# Altium schematic sheet SPDIF.SchDoc: Apalis Evaluation Board 1.1
size A3; Organization: Toradex AG; Address1: Altsagenstrasse 5; Address2: Horw; Address3: 6048; Address4: Switzerland; DocumentNumber: 13; Revision: V1.1; SheetNumber: 13; SheetTotal: 32; PageSetup: Record=PageOptions|CenterHorizontal=True|CenterVertical=True|PrintScale=0.73|XCorrection=1.00|YCorrection=1.00|PrintKind=0|BorderSize=5000000|LeftOffset=0|BottomOffset=0|Orientation=2|PaperLength=1000|PaperWidth=1000|Scale=100|PaperSource=7|PrintQuality=-4|MediaType=1|DitherType=10|PaperKind=A4|PrintScaleMode=1
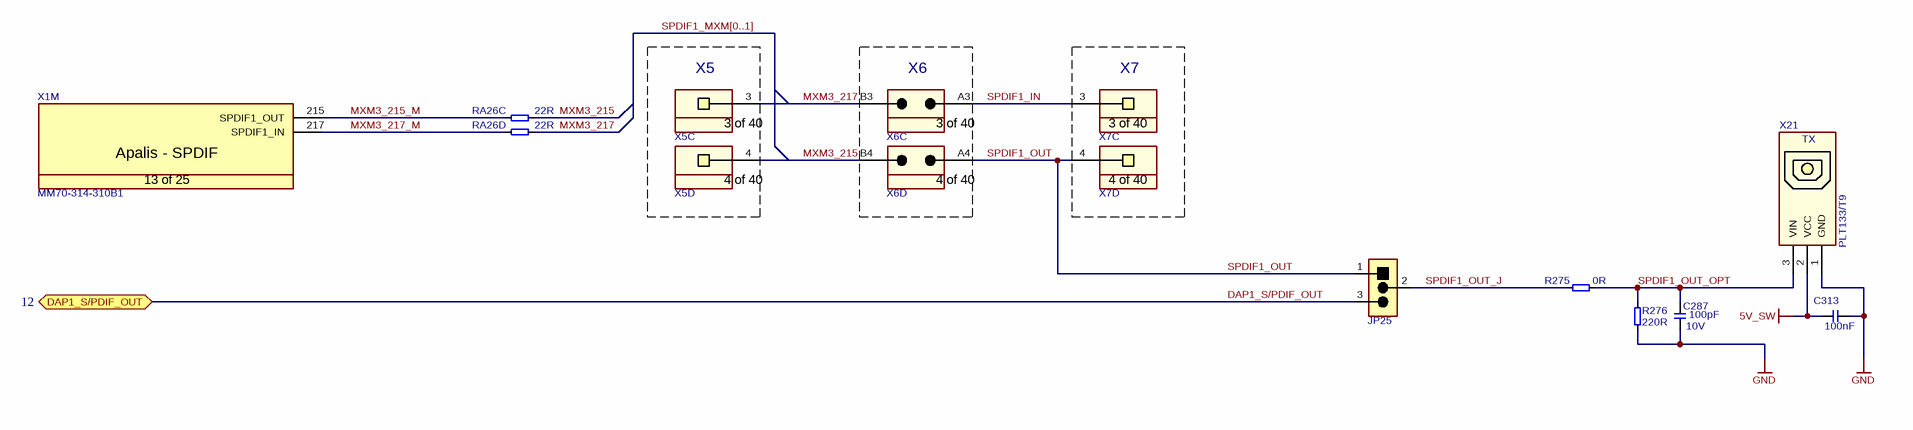
[diagram p0: SPDIF.SchDoc]

## Parts
C287  Rating: 10V  [T_CAPC0603X33N]  (hidden comment: 100pF)
C313  100nF  [T_CAPC0603X33N]
JP25  826936-3  [T_TYCO_826936-3]  (value not drawn)
R275  0R  [T_RESC0603X30N]
R276  220R  [T_RESC0603X30N]
RA26  22R  [T_Resistor_Array_X4]  (parts C,D of 4)
X1  Manufacturer Part No.: MM70-314-310B1  [T_JAE_MM70-314-310B1]  (hidden comment: CON-JAE-MM70-314-310B1-314-0.5mm)  (part M of 25)
X5  SSW-110-01-G-S  [T_Samtec_SSW-110-01-G-S]  (value not drawn)  (parts C,D of 40)
X6  TSW-110-07-G-D  [T_Samtec_TSW-110-07-G-D]  (value not drawn)  (parts C,D of 40)
X7  SSW-110-01-G-S  [T_Samtec_SSW-110-01-G-S]  (value not drawn)  (parts C,D of 40)
X21  PLT133/T9  [T_EVERLIGHT_PLT133/T9]

## Blocks framed on the sheet
X5: X5
X6: X6
X7: X7

## Ports
DAP1_S/PDIF_OUT (bidir, see 12)

## Nets
5V_SW: C313.1 X21.2(VCC)
GND: C287.1 C313.2 R276.1 X21.1(GND)
DAP1_S/PDIF_OUT: JP25.3 ; port DAP1_S/PDIF_OUT
MXM3_215: RA26.7 X5.4 X6.B4
MXM3_215_M: RA26.3 X1.215(SPDIF1_OUT)
MXM3_217: RA26.8 X5.3 X6.B3
MXM3_217_M: RA26.4 X1.217(SPDIF1_IN)
SPDIF1_IN: X6.A3 X7.3
SPDIF1_OUT: JP25.1 X6.A4 X7.4
SPDIF1_OUT_J: JP25.2 R275.1
SPDIF1_OUT_OPT: C287.2 R275.2 R276.2 X21.3(VIN)

## Buses and harness runs
bus SPDIF1_MXM[0..1]

## Notes on the sheet
- Title
- Size:
- Date:
- A3
- Number:
- Time:
- Revision:
- Sheet
- of
- File:
- (in symbol CON-JAE-MM70-314-310B1-314-0.5mm, part M) Apalis - SPDIF; 13 of 25
- (in symbol CON-Samtec-SSW-110-01-G-S, part C) 3 of 40
- (in symbol CON-Samtec-SSW-110-01-G-S, part D) 4 of 40
- (in symbol CON-Samtec-TSW-110-07-G-D, part C) 3 of 40
- (in symbol CON-Samtec-TSW-110-07-G-D, part D) 4 of 40
- (in symbol IF-Everlight-PLT133/T9) TX

## Library data of the parts
C287 = C-X7R-100pF-10V-20%-0603: Capacitor Ceramic X7R 100pF 10V 20% 0603; Tolerance: 20%; Type: X7R; Value: 100pF
C313 = C-X7R-100nF-16V-10%-0603: Capacitor Ceramic X7R 100nF 16V 10% 0603; Tolerance: 10%; Type: X7R; Value: 100nF
JP25 = CON-Tyco-826936-3-1X3-2.54mm-JP_1: Jumper, 3-Pin; Manufacturer Name: Tyco; No. of ways: 1X3; Pitch: 2.54mm; Manufacturer Part No.: 826936-3
R275 = R-0R-63mW-1%-0603: Resistor 0 ohm 63mW 1% 0603; Rating: 63mW; Tolerance: 1%; Value: 0R
R276 = R-220R-63mW-5%-0603: Resistor 220 ohm 63mW 5% 0603; Rating: 63mW; Tolerance: 5%; Value: 220R
RA26 = RA-22R-63mW-5%-1206-div: Resistor Array 22 R 63mW 5% 1206; Tolerance: 5%; Power Dissipation: 63mW; Value: 22R
X1 = CON-JAE-MM70-314-310B1-314-0.5mm: MXM3 Connector; Manufacturer Name: JAE; No. of ways: 314
X5 X7 = CON-Samtec-SSW-110-01-G-S: Receptacle Female Socket 1x40 pin 2.54mm pitch; Manufacturer Name: Samtec; Pitch: 2.54mm; No. of ways: 1x40; Manufacturer Part No.: SSW-110-01-G-S
X6 = CON-Samtec-TSW-110-07-G-D: Header 2x40 pin 2.54mm pitch; Manufacturer Name: Samtec; Pitch: 2.54mm; No. of ways: 2x40; Manufacturer Part No.: TSW-110-07-G-D
X21 = IF-Everlight-PLT133/T9: Photolink- Fiber Optic Transmitter; No. of ways: 3; Manufacturer Name: Everlight; Manufacturer Part No.: PLT133/T9